# Altium project PCB_Project.PrjPcb
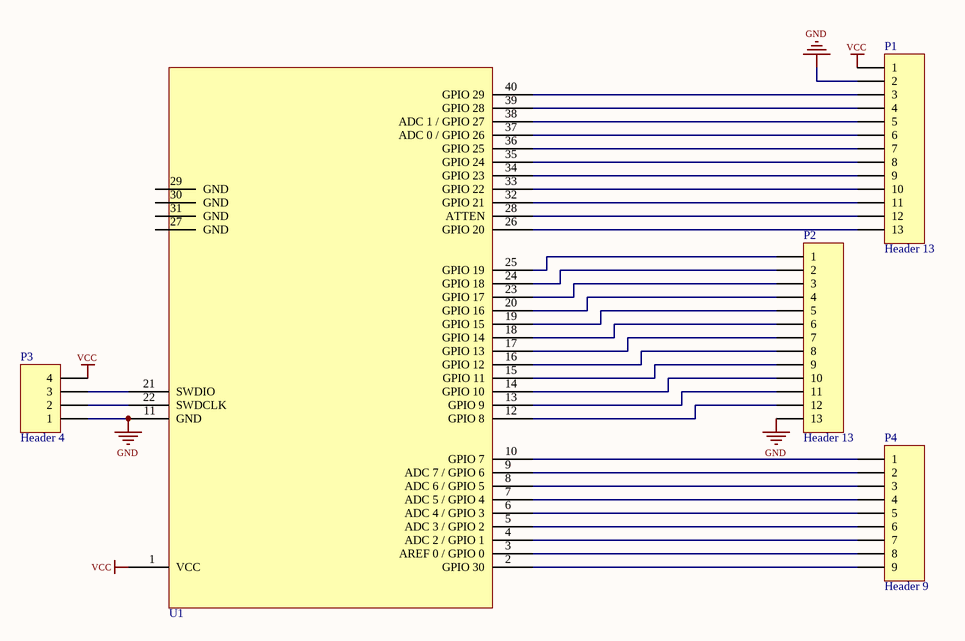
[diagram p0: Sheet1.SchDoc]
1 sheet, 5 parts. Net scope: global (net labels, ports and power ports of the same name join across sheets).
Board file: PCB1.PcbDoc

## Sheet Sheet1.SchDoc
size A

### Parts
P1  Header 13  [HDR1X13]
P2  Header 13  [HDR1X13]
P3  Header 4  [HDR1X4]
P4  Header 9  [HDR1X9]
U1  nRF51-01/02  [nRF51-01/02]  (value not drawn)

### Nets
GND: P1.2 P2.13 P3.1 U1.11(GND)
VCC: P1.1 P3.4 U1.1(VCC)
NetP1_3: P1.3 U1.40(GPIO_29)
NetP1_4: P1.4 U1.39(GPIO_28)
NetP1_5: P1.5 U1.38(ADC_1_/_GPIO_27)
NetP1_6: P1.6 U1.37(ADC_0_/_GPIO_26)
NetP1_7: P1.7 U1.36(GPIO_25)
NetP1_8: P1.8 U1.35(GPIO_24)
NetP1_9: P1.9 U1.34(GPIO_23)
NetP1_10: P1.10 U1.33(GPIO_22)
NetP1_11: P1.11 U1.32(GPIO_21)
NetP1_12: P1.12 U1.28(ATTEN)
NetP1_13: P1.13 U1.26(GPIO_20)
NetP2_1: P2.1 U1.25(GPIO_19)
NetP2_2: P2.2 U1.24(GPIO_18)
NetP2_3: P2.3 U1.23(GPIO_17)
NetP2_4: P2.4 U1.20(GPIO_16)
NetP2_5: P2.5 U1.19(GPIO_15)
NetP2_6: P2.6 U1.18(GPIO_14)
NetP2_7: P2.7 U1.17(GPIO_13)
NetP2_8: P2.8 U1.16(GPIO_12)
NetP2_9: P2.9 U1.15(GPIO_11)
NetP2_10: P2.10 U1.14(GPIO_10)
NetP2_11: P2.11 U1.13(GPIO_9)
NetP2_12: P2.12 U1.12(GPIO_8)
NetP3_2: P3.2 U1.22(SWDCLK)
NetP3_3: P3.3 U1.21(SWDIO)
NetP4_1: P4.1 U1.10(GPIO_7)
NetP4_2: P4.2 U1.9(ADC_7_/_GPIO_6)
NetP4_3: P4.3 U1.8(ADC_6_/_GPIO_5)
NetP4_4: P4.4 U1.7(ADC_5_/_GPIO_4)
NetP4_5: P4.5 U1.6(ADC_4_/_GPIO_3)
NetP4_6: P4.6 U1.5(ADC_3_/_GPIO_2)
NetP4_7: P4.7 U1.4(ADC_2_/_GPIO_1)
NetP4_8: P4.8 U1.3(AREF_0_/_GPIO_0)
NetP4_9: P4.9 U1.2(GPIO_30)

Not connected (* = marked no-connect by the designer): U1 27(GND) 29(GND) 30(GND) 31(GND)

### Library data of the parts
P1 P2 = Header 13: Header, 13-Pin; LatestRevisionDate: 17-Jul-2002; LatestRevisionNote: Re-released for DXP Platform.; Publisher: Altium Limited
P3 = Header 4: Header, 4-Pin; LatestRevisionDate: 17-Jul-2002; LatestRevisionNote: Re-released for DXP Platform.; Publisher: Altium Limited
P4 = Header 9: Header, 9-Pin; LatestRevisionDate: 17-Jul-2002; LatestRevisionNote: Re-released for DXP Platform.; Publisher: Altium Limited
U1 = nRF51-01/02: Bluetooth uController